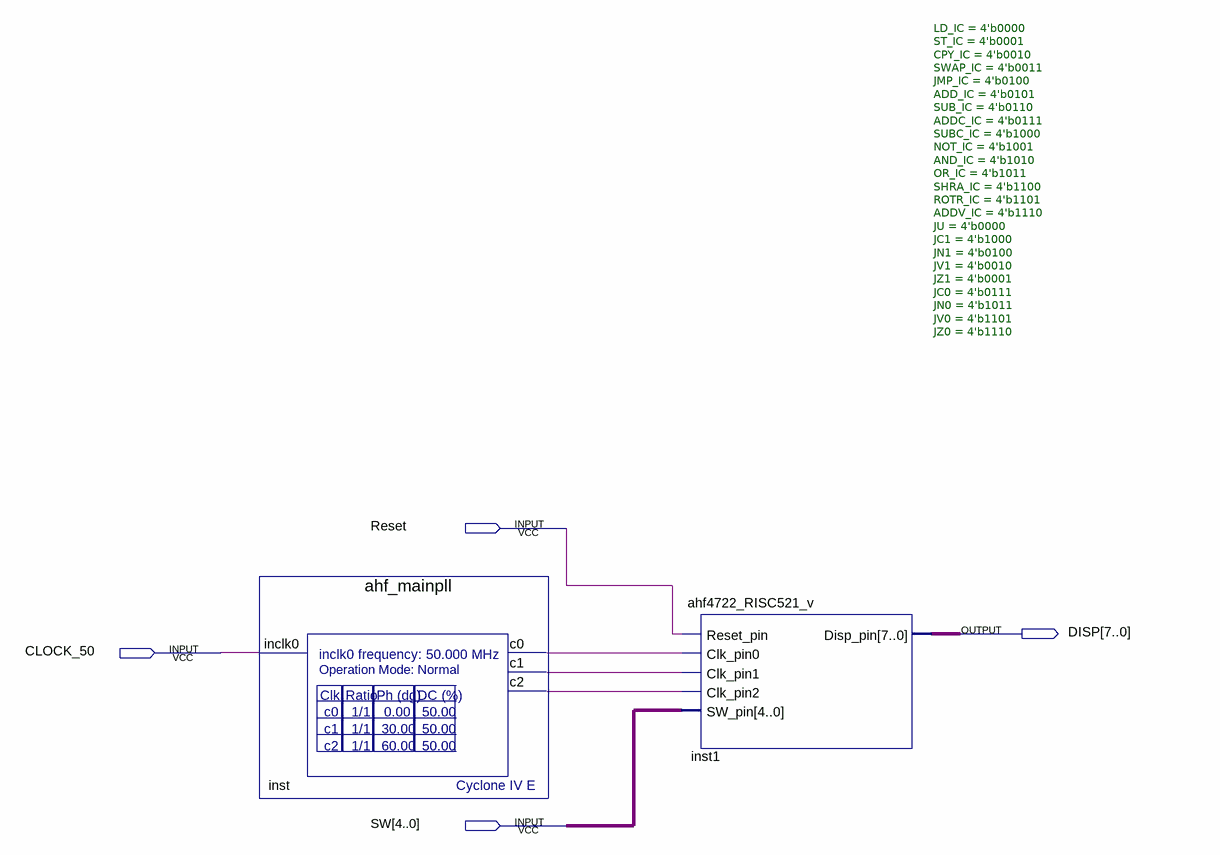
[diagram p0: schematic sheet]
// Quartus schematic ahf_RISC521_brdRDYblck.bdf as structural Verilog: 2 symbols, 4 pins
module ahf_RISC521_brdRDYblck (
  input  Reset,
  input  CLOCK_50,
  input  [4:0] SW,
  output [7:0] DISP
);

  wire inst_c0, inst_c1, inst_c2;

  ahf_mainpll inst (.inclk0(CLOCK_50), .c0(inst_c0), .c1(inst_c1), .c2(inst_c2));
  ahf4722_RISC521_v #(.LD_IC(4'b0000), .ST_IC(4'b0001), .CPY_IC(4'b0010), .SWAP_IC(4'b0011), .JMP_IC(4'b0100), .ADD_IC(4'b0101), .SUB_IC(4'b0110), .ADDC_IC(4'b0111), .SUBC_IC(4'b1000), .NOT_IC(4'b1001), .AND_IC(4'b1010), .OR_IC(4'b1011), .SHRA_IC(4'b1100), .ROTR_IC(4'b1101), .ADDV_IC(4'b1110), .JU(4'b0000), .JC1(4'b1000), .JN1(4'b0100), .JV1(4'b0010), .JZ1(4'b0001), .JC0(4'b0111), .JN0(4'b1011), .JV0(4'b1101), .JZ0(4'b1110)) inst1 (
    .Reset_pin(Reset), .Clk_pin0(inst_c0), .Clk_pin1(inst_c1), .Clk_pin2(inst_c2), .SW_pin(SW),
    .Disp_pin(DISP));
endmodule
